# Altium schematic sheet MCU.SchDoc
size A4
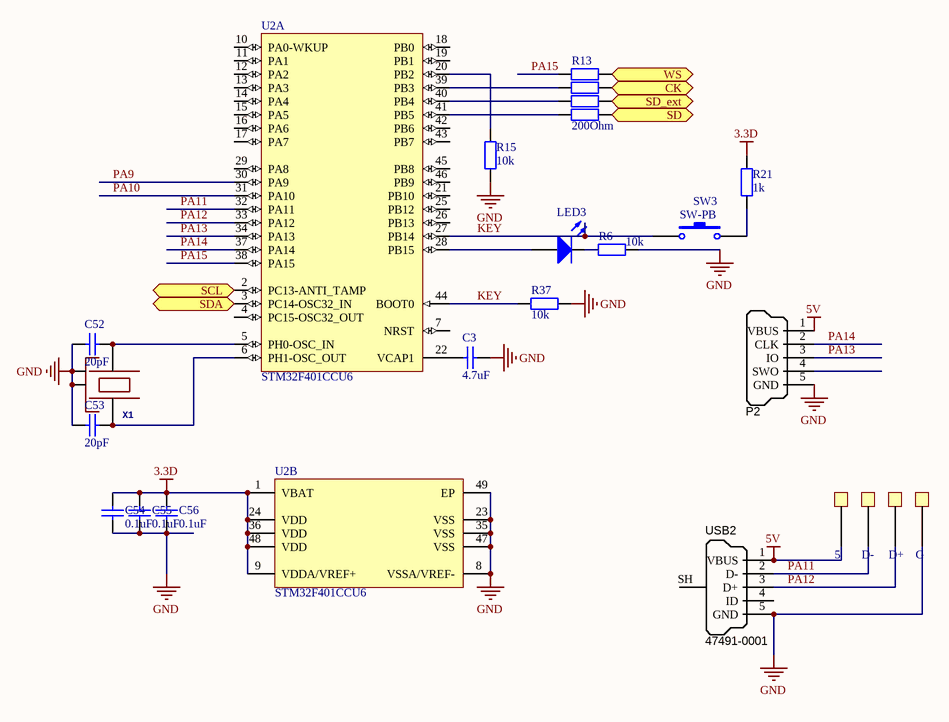
[diagram p0: MCU.SchDoc]

## Parts
5  TestPad  [TestPad]  (value not drawn)
C3  value 4.7uF  [0603L]  (hidden comment: Cap)
C52  value 20pF  [0402]  (hidden comment: Cap)
C53  value 20pF  [0402]  (hidden comment: Cap)
C54  value 0.1uF  [0402]  (hidden comment: Cap)
C55  value 0.1uF  [0402]  (hidden comment: Cap)
C56  value 0.1uF  [0402]  (hidden comment: Cap)
D+  TestPad  [TestPad]  (value not drawn)
D-  TestPad  [TestPad]  (value not drawn)
G  TestPad  [TestPad]  (value not drawn)
LED3  LED0  [0603]  (value not drawn)
P2  SWD_MicroUSB  [MICRO-YZX]  (value not drawn)
R6  10k  [0402]
R13  value 200Ohm  [0402X4]  (hidden comment: Res*4)
R15  10k  [0402]
R21  1k  [0402]
R37  value 10k  [0402]  (hidden comment: Res2)
SW3  SW-PB  [SW3x4]
U2  STM32F401CCU6  [STM-UFQFPN48_N]  (parts A,B of 2)
USB2  Manufacturer Part Number 1: 47491-0001  [MICRO-YZX]  (hidden comment: USB Micro Type B)
X1  24.000 KHz 3.2x2.5mm 8-10pf  [OSCILLATOR-2.5x2.0]  (value not drawn)

## Ports
CK, SCL, SD, SD_ext, SDA, WS

## Nets
3.3D: C54.2 C55.2 C56.2 R21.2 U2.1(VBAT) U2.9(VDDA/VREF+) U2.24(VDD) U2.36(VDD) U2.48(VDD)
5V: 5.1 P2.1(VBUS) USB2.1(VBUS)
GND: C3.1 C52.1 C53.1 C54.1 C55.1 C56.1 G.1 P2.5(GND) R6.2 R15.2 R37.2 U2.8(VSSA/VREF-) U2.23(VSS) U2.35(VSS) U2.47(VSS) U2.49(EP) USB2.5(GND) X1.2(NC_2) X1.4(NC_4)
CK: R13.2 ; port CK
KEY: R37.1 SW3.1 U2.27(PB14) U2.44(BOOT0)
PA9: U2.30(PA9)
PA10: U2.31(PA10)
PA11: D-.1 U2.32(PA11) USB2.2(D-)
PA12: D+.1 U2.33(PA12) USB2.3(D+)
PA13: P2.3(IO) U2.34(PA13)
PA14: P2.2(CLK) U2.37(PA14)
PA15: R13.8 U2.38(PA15)
SCL: U2.2(PC13-ANTI_TAMP) ; port SCL
SD: R13.4 ; port SD
SD_ext: R13.3 ; port SD_ext
SDA: U2.3(PC14-OSC32_IN) ; port SDA
WS: R13.1 ; port WS
NetC3_2: C3.2 U2.22(VCAP1)
NetC52_2: C52.2 U2.5(PH0-OSC_IN) X1.1
NetC53_2: C53.2 U2.6(PH1-OSC_OUT) X1.3
NetLED3_1: LED3.1(A) U2.28(PB15)
NetLED3_2: LED3.2(K) R6.1
NetR13_5: R13.5 U2.41(PB5)
NetR13_6: R13.6 U2.40(PB4)
NetR13_7: R13.7 U2.39(PB3)
NetR15_1: R15.1 U2.20(PB2)
NetR21_1: R21.1 SW3.2

Not connected (* = marked no-connect by the designer): P2 4(SWO); U2 4(PC15-OSC32_OUT) 7(NRST) 10(PA0-WKUP) 11(PA1) 12(PA2) 13(PA3) 14(PA4) 15(PA5) 16(PA6) 17(PA7) 18(PB0) 19(PB1) 21(PB10) 25(PB12) 26(PB13) 29(PA8) 42(PB6) 43(PB7) 45(PB8) 46(PB9); USB2 4(ID) SH(Shell)

## Library data of the parts
C3 C52-C56 = Cap: Capacitor; Published: 8-Jun-2000; LatestRevisionDate: 17-Jul-2002; LatestRevisionNote: Re-released for DXP Platform.; PackageReference: RAD-0.3; Publisher: Altium Limited; PackageDescription: Radial Cap, Thru-Hole; 2 Leads; 0.3 in Pin Spacing
LED3 = LED0: Typical INFRARED GaAs LED; Published: 8-Jun-2000; LatestRevisionDate: 08-Jul-2005; LatestRevisionNote: Mech Layer 1 removed.; PackageReference: LED-0; Publisher: Altium Limited; PackageDescription: LED; 2 Leads
P2 = SWD_MicroUSB: Connector SMD USB Micro Type B middle mount; Manufacturer 1: Molex Inc; SCDType: undef; Package / Case: SMD; Supplier 1: Digi-Key; Supplier Part Number 1: WM17142CT-ND
R6 R15 R21 = Res2: Resistor; Value: 0Ohm; Published: 8-Jun-2000; LatestRevisionDate: 17-Jul-2002; LatestRevisionNote: Re-released for DXP Platform.; PackageReference: AXIAL-0.4; Publisher: Altium Limited; PackageDescription: Axial Device, Thru-Hole; 2 Leads; 0.4 in Pin Spacing
R13 = Res*4: Resistor; Published: 8-Jun-2000; LatestRevisionDate: 17-Jul-2002; LatestRevisionNote: Re-released for DXP Platform.; PackageReference: AXIAL-0.4; Publisher: Altium Limited; PackageDescription: Axial Device, Thru-Hole; 2 Leads; 0.4 in Pin Spacing
R37 = Res2: Resistor; Published: 8-Jun-2000; LatestRevisionDate: 17-Jul-2002; LatestRevisionNote: Re-released for DXP Platform.; PackageReference: AXIAL-0.4; Publisher: Altium Limited; PackageDescription: Axial Device, Thru-Hole; 2 Leads; 0.4 in Pin Spacing
SW3 = SW-PB: Switch; Published: 24-Mar-1999; LatestRevisionDate: 17-Jul-2002; LatestRevisionNote: Re-released for DXP Platform.; PackageReference: SPST-2; Publisher: Altium Limited; PackageDescription: Switch; 2 Leads
U2 = STM32F401CCU6: ARM Cortex-M4 32-bit MCU+FPU, 105 DMIPS, 256 kB Flash, 64 kB Internal RAM, 36 I/Os, 48-pin UFQFPN, -40 to 85 degC, Tray; Manufacturer: STMicroelectronics; FLASH Size (Prog) (kB): 256; I/Os (High Current): 36; Internal RAM Size (kB): 64; Operating Frequency(F) (Processor speed) (MHz): 84; Supply Voltage(Vcc) max (V): 3.6; Supply Voltage(Vcc) min (V): 1.8; DatasheetVersion: Rev. 1; PackageVersion: Rev. 1, 04/2013; PackageReference: UFQFPN48; PackageDescription: 48-Pin Ultra Thin Fine Pitch Quad Flat No-Lead, 7 x 7 x 0.6 mm Body, 0.5 mm Pitch, Exposed Pad; Supplier 1: Newark; Supplier Part Number 1: 19X6217; Supplier 2: Mouser; Supplier Part Number 2: 511-STM32F401CCU6; Core: ARM Cortex-M4; Packing: Tray; Mounting Technology: Surface Mount; PartNumber: STM32F401CCU6; ComponentLink1Description: Manufacturer URL; ComponentLink1URL: http://www.st.com/web/en/home.html; ComponentLink2Description: Datasheet; ComponentLink2URL: http://www.st.com/st-web-ui/static/active/en/resource/technical/document/data_brief/DM00071938.pdf; ComponentLink3Description: Package Specification; ComponentLink3URL: http://www.st.com/st-web-ui/static/active/en/resource/technical/document/data_brief/DM00071938.pdf
USB2 = USB_Micro_TypeB: Connector SMD USB Micro Type B middle mount; Manufacturer 1: Molex Inc; SCDType: undef; Package / Case: SMD; Supplier 1: Digi-Key; Supplier Part Number 1: WM17142CT-ND
X1 = OSCILLATOR-3.2X2.5: Crystal Oscillator in 3.2x2.5 SMD